# Altium schematic sheet EZ_FPGA_Bridge.SchDoc
size A3
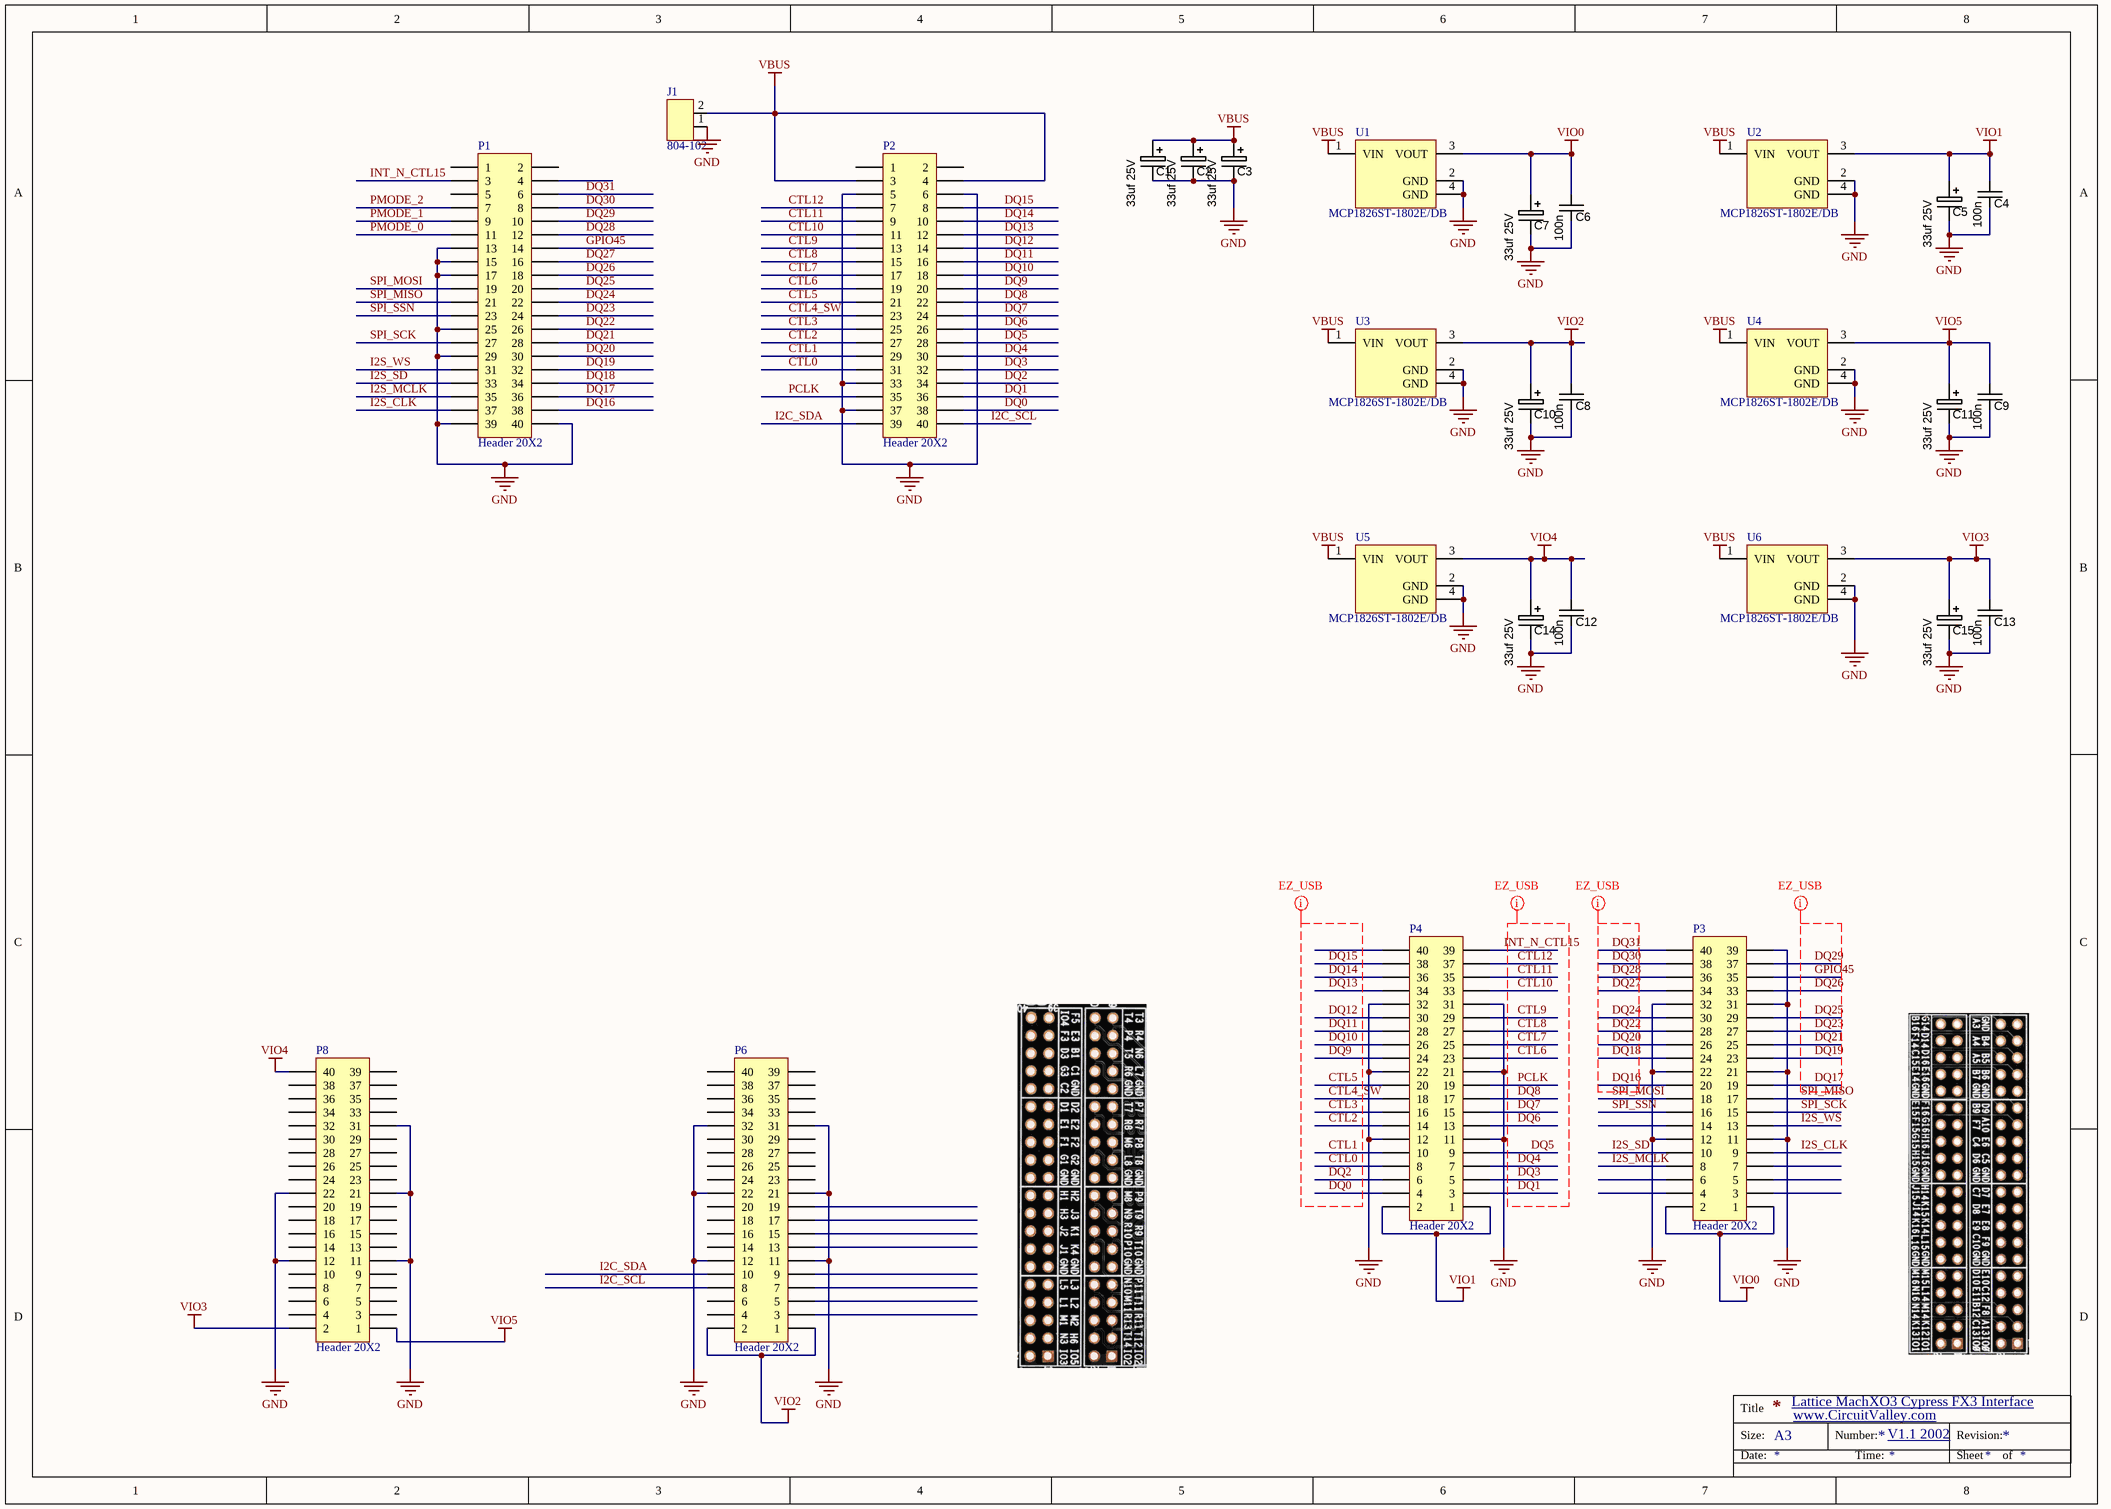
[diagram p0: EZ_FPGA_Bridge.SchDoc]

## Parts
C1  value 33uf 25V  [CAPMP7343X310N]  (hidden comment: 33uf 20V D)
C2  value 33uf 25V  [CAPMP7343X310N]  (hidden comment: 33uf 20V D)
C3  value 33uf 25V  [CAPMP7343X310N]  (hidden comment: 33uf 20V D)
C4  100n  [CAPC1608N]
C5  value 33uf 25V  [CAPMP7343X310N]  (hidden comment: 33uf 20V D)
C6  100n  [CAPC1608N]
C7  value 33uf 25V  [CAPMP7343X310N]  (hidden comment: 33uf 20V D)
C8  100n  [CAPC1608N]
C9  100n  [CAPC1608N]
C10  value 33uf 25V  [CAPMP7343X310N]  (hidden comment: 33uf 20V D)
C11  value 33uf 25V  [CAPMP7343X310N]  (hidden comment: 33uf 20V D)
C12  100n  [CAPC1608N]
C13  100n  [CAPC1608N]
C14  value 33uf 25V  [CAPMP7343X310N]  (hidden comment: 33uf 20V D)
C15  value 33uf 25V  [CAPMP7343X310N]  (hidden comment: 33uf 20V D)
J1  804-102  [804-102]
P1  Header 20X2  [HDR2X20]
P2  Header 20X2  [HDR2X20]
P3  Header 20X2  [HDR2X20]
P4  Header 20X2  [HDR2X20]
P6  Header 20X2  [HDR2X20]
P8  Header 20X2  [HDR2X20]
U1  MCP1826ST-1802E/DB  [SOT-223-DB3_N]
U2  MCP1826ST-1802E/DB  [SOT-223-DB3_N]
U3  MCP1826ST-1802E/DB  [SOT-223-DB3_N]
U4  MCP1826ST-1802E/DB  [SOT-223-DB3_N]
U5  MCP1826ST-1802E/DB  [SOT-223-DB3_N]
U6  MCP1826ST-1802E/DB  [SOT-223-DB3_N]

## Nets
GND: C1.2 C2.2 C3.2 C4.1 C5.2 C6.1 C7.2 C8.1 C9.1 C10.2 C11.2 C12.1 C13.1 C14.2 C15.2 J1.1(PW) P1.13 P1.15 P1.17 P1.25 P1.29 P1.39 P1.40 P2.5 P2.6 P2.33 P2.37 P3.11 P3.12 P3.21 P3.22 P3.31 P3.32 P3.39 P4.11 P4.12 P4.21 P4.22 P4.31 P4.32 P6.11 P6.12 P6.21 P6.22 P6.31 P6.32 P8.11 P8.12 P8.21 P8.22 P8.31 U1.2(GND) U1.4(GND) U2.2(GND) U2.4(GND) U3.2(GND) U3.4(GND) U4.2(GND) U4.4(GND) U5.2(GND) U5.4(GND) U6.2(GND) U6.4(GND)
VBUS: C1.1 C2.1 C3.1 J1.2(PW) P2.3 P2.4 U1.1(VIN) U2.1(VIN) U3.1(VIN) U4.1(VIN) U5.1(VIN) U6.1(VIN)
VIO0: C6.2 C7.1 P3.1 P3.2 U1.3(VOUT)
VIO1: C4.2 C5.1 P4.1 P4.2 U2.3(VOUT)
VIO2: C8.2 C10.1 P6.1 P6.2 U3.3(VOUT)
VIO3: C13.2 C15.1 P8.2 U6.3(VOUT)
VIO4: C12.2 C14.1 P8.40 U5.3(VOUT)
VIO5: C9.2 C11.1 P8.1 U4.3(VOUT)
CTL0: P2.31 P4.8
CTL1: P2.29 P4.10
CTL2: P2.27 P4.14
CTL3: P2.25 P4.16
CTL4_SW: P2.23 P4.18
CTL5: P2.21 P4.20
CTL6: P2.19 P4.23
CTL7: P2.17 P4.25
CTL8: P2.15 P4.27
CTL9: P2.13 P4.29
CTL10: P2.11 P4.33
CTL11: P2.9 P4.35
CTL12: P2.7 P4.37
DQ0: P2.38 P4.4
DQ1: P2.36 P4.3
DQ2: P2.34 P4.6
DQ3: P2.32 P4.5
DQ4: P2.30 P4.7
DQ5: P2.28 P4.9
DQ6: P2.26 P4.13
DQ7: P2.24 P4.15
DQ8: P2.22 P4.17
DQ9: P2.20 P4.24
DQ10: P2.18 P4.26
DQ11: P2.16 P4.28
DQ12: P2.14 P4.30
DQ13: P2.12 P4.34
DQ14: P2.10 P4.36
DQ15: P2.8 P4.38
DQ16: P1.38 P3.20
DQ17: P1.36 P3.19
DQ18: P1.34 P3.24
DQ19: P1.32 P3.23
DQ20: P1.30 P3.26
DQ21: P1.28 P3.25
DQ22: P1.26 P3.28
DQ23: P1.24 P3.27
DQ24: P1.22 P3.30
DQ25: P1.20 P3.29
DQ26: P1.18 P3.33
DQ27: P1.16 P3.34
DQ28: P1.12 P3.36
DQ29: P1.10 P3.37
DQ30: P1.8 P3.38
DQ31: P1.6 P3.40
GPIO45: P1.14 P3.35
I2C_SCL: P2.40 P6.8
I2C_SDA: P2.39 P6.10
I2S_CLK: P1.37 P3.9
I2S_MCLK: P1.35 P3.8
I2S_SD: P1.33 P3.10
I2S_WS: P1.31 P3.13
INT_N_CTL15: P1.3 P4.39
PCLK: P2.35 P4.19
PMODE_0: P1.11
PMODE_1: P1.9
PMODE_2: P1.7
SPI_MISO: P1.21 P3.17
SPI_MOSI: P1.19 P3.18
SPI_SCK: P1.27 P3.15
SPI_SSN: P1.23 P3.16

Not connected (* = marked no-connect by the designer): P1 1 2 4 5; P2 1 2; P3 3 4 5 6 7 14; P4 40; P6 3 4 5 6 7 9 13 14 15 16 17 18 19 20 23 24 25 26 27 28 29 30 33 34 35 36 37 38 39 40; P8 3 4 5 6 7 8 9 10 13 14 15 16 17 18 19 20 23 24 25 26 27 28 29 30 32 33 34 35 36 37 38 39

## Layout directives
net class EZ_USB: CTL0, CTL1, CTL2, CTL3, CTL4_SW, CTL5, CTL6, CTL7, CTL8, CTL9, CTL10, CTL11, CTL12, DQ0, DQ1, DQ2, DQ3, DQ4, DQ5, DQ6, DQ7, DQ8, DQ9, DQ10, DQ11, DQ12, DQ13, DQ14, DQ15, DQ16, DQ17, DQ18, DQ19, DQ20, DQ21, DQ22, DQ23, DQ24, DQ25, DQ26, DQ27, DQ28, DQ29, DQ30, DQ31, GPIO45, PCLK

## Notes on the sheet
- Lattice MachXO3 Cypress FX3 Interface
- www.CircuitValley.com
- V1.1 2002
- Title
- Size:
- Date:
- A3
- Number:
- Time:
- Revision:
- Sheet
- of

## Library data of the parts
C1-C3 C5 C7 C10 C11 C14 C15 = CAPT_330u_2917_6V3: Capacitor SMD Tant 330uF 20% 6V3 2917; Manufacturer Part Number: T520D337M006ATE015; Part: TAJD336K020R; Ratings: 6.3V; Material: Solid Tantalum; ESR (Equivalent Series Resistance): 15 mOhm; Package / Case: 2917 (7343 Metric); Tolerance: ±20%; Operating Temperature: -55°C ~ 125°C; Size / Dimension: 0.287" L x 0.169" W (7.30mm x 4.30mm); Height - Seated (Max): 0.122" (3.10mm); Manufacturer Size Code: D; Supplier 1: Digi-Key; Supplier Part Number 1: 399-4052-1-ND; ComponentLink1URL: http://www.kemet.com/datasheets&T520D337M006ATE015; ComponentLink1Description: T520D Datasheet
C4 C6 C8 C9 C12 C13 = CAPC_10p_0603_NP0_1%_50V: Capacitor SMD Cer 10pF 5% 50V NP0 0603; Manufacturer 1: Murata Electronics North America; Manufacturer Part Number 1: GRM1885C1H100FA01J; Part: C0603X104K5RAC; Ratings: 50V; NP0; Tolerance: ±5%; Operating Temperature: -55°C ~ 125°C; Package / Case: 0603 (1608 Metric); Size / Dimension: 0.063" L x 0.032" W (1.60mm x 0.81mm); Thickness (Max): 0.035" (0.90mm); Supplier 1: Digi-Key; Supplier Part Number 1: GRM1885C1H100FA01J-ND; Value: 100n
P1-P4 P6 P8 = Header 20X2: Header, 20-Pin, Dual row; LatestRevisionDate: 17-Jul-2002; LatestRevisionNote: Re-released for DXP Platform.; Publisher: Altium Limited
U1-U6 = MCP1826ST-1802E/DB: 1000 mA, Low Voltage, Low Quiescent Current LDO Regulator, 3-Pin SOT-223, Extended Temperature, Tape and Reel; Published: 29-Jan-2009; DatasheetVersion: revA, Aug-2007; PackageVersion: revBB, Aug-2009; PackageReference: SOT-223-DB3; Publisher: Altium Limited; PackageDescription: 3-Lead Plastic Small Outline Transistor (DB) [SOT-223]; Supplier 1: Digi-Key; Supplier Part Number 1: MCP1826ST-1802E/DBTR-ND; ComponentLink1Description: Datasheet; ComponentLink1URL: http://ww1.microchip.com/downloads/en/DeviceDoc/22057a.pdf; ComponentLink2Description: Packaging Specification; ComponentLink2URL: http://www.microchip.com/stellent/groups/techpub_sg/documents/packagingspec/en012702.pdf; ComponentLink3Description: Microchip.com Home; ComponentLink3URL: http://www.microchip.com/
J1 = 804-102: Part: 804-102